# Altium schematic sheet Top-Sheet.SchDoc
size A4; DocumentNumber: 1; SheetNumber: 1; SheetTotal: 5
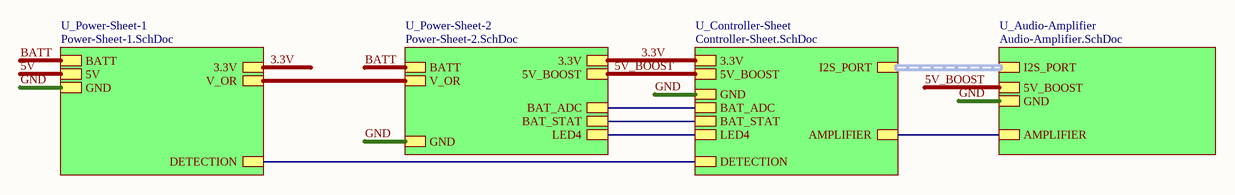
[diagram p0: Top-Sheet.SchDoc]

## Sub-sheets
U_Audio-Amplifier = Audio-Amplifier.SchDoc: I2S_PORT (harness I2S_PORT), GND, 5V_BOOST, AMPLIFIER
U_Controller-Sheet = Controller-Sheet.SchDoc: I2S_PORT (harness I2S_PORT), GND, BAT_ADC, BAT_STAT, 3.3V, DETECTION, AMPLIFIER, 5V_BOOST, LED4
U_Power-Sheet-1 = Power-Sheet-1.SchDoc: 5V, 3.3V, BATT, V_OR, GND, DETECTION
U_Power-Sheet-2 = Power-Sheet-2.SchDoc: BATT, GND, 5V_BOOST, V_OR, BAT_ADC, BAT_STAT, 3.3V, LED4

## Nets
3.3V: sheet U_Controller-Sheet/3.3V, sheet U_Power-Sheet-1/3.3V, sheet U_Power-Sheet-2/3.3V
5V: sheet U_Power-Sheet-1/5V
5V_BOOST: sheet U_Audio-Amplifier/5V_BOOST, sheet U_Controller-Sheet/5V_BOOST, sheet U_Power-Sheet-2/5V_BOOST
BATT: sheet U_Power-Sheet-1/BATT, sheet U_Power-Sheet-2/BATT
GND: sheet U_Audio-Amplifier/GND, sheet U_Controller-Sheet/GND, sheet U_Power-Sheet-1/GND, sheet U_Power-Sheet-2/GND
(unnamed): sheet U_Audio-Amplifier/AMPLIFIER, sheet U_Controller-Sheet/AMPLIFIER
(unnamed): sheet U_Controller-Sheet/BAT_ADC, sheet U_Power-Sheet-2/BAT_ADC
(unnamed): sheet U_Controller-Sheet/BAT_STAT, sheet U_Power-Sheet-2/BAT_STAT
(unnamed): sheet U_Controller-Sheet/DETECTION, sheet U_Power-Sheet-1/DETECTION
(unnamed): sheet U_Controller-Sheet/LED4, sheet U_Power-Sheet-2/LED4
(unnamed): sheet U_Power-Sheet-1/V_OR, sheet U_Power-Sheet-2/V_OR

## Buses and harness runs
harness sheet U_Audio-Amplifier/I2S_PORT = sheet U_Controller-Sheet/I2S_PORT

## Notes on the sheet
- File:
- Title:
- Date:
- Page
- Num:
- Total:
- Drawn By: Huzaifa Ali